# Altium schematic sheet Архитектура.SchDoc
size A4; SheetNumber: 1; SheetTotal: 3
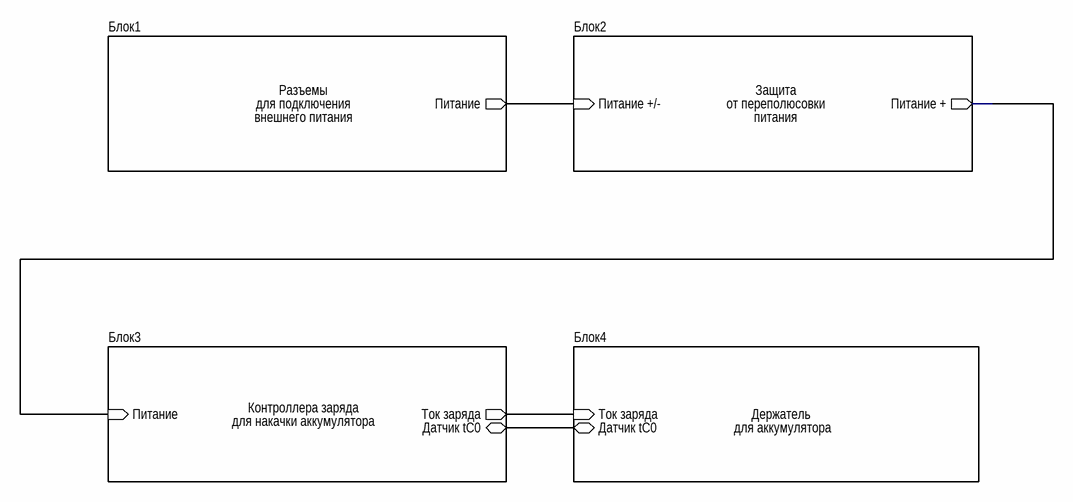
[diagram p0: Архитектура.SchDoc]

## Sub-sheets
Блок1 = Блок1.SchDoc: Питание (out)  | Parameter 1: Разъемы; Parameter 2: для подключения; Parameter 3: внешнего питания
Блок2 = Блок2.SchDoc: Питание +/- (in), Питание + (out)  | Parameter 1: Защита; Parameter 2: от переполюсовки; Parameter 3: питания
Блок3 = Блок3.SchDoc: Питание (in), Ток заряда (out), Датчик tC0 (bidir)  | Parameter 1: Контроллера заряда; Parameter 2: для накачки аккумулятора; Parameter 3: для накачки аккумулятора
Блок4 = Блок4.SchDoc: Ток заряда (in), Датчик tC0 (bidir)  | Parameter 1: Держатель; Parameter 2: для аккумулятора; Parameter 3: -

## Nets
(unnamed): sheet Блок1/Питание, sheet Блок2/Питание +/-
(unnamed): sheet Блок3/Питание, sheet Блок2/Питание +
(unnamed): sheet Блок3/Ток заряда, sheet Блок4/Ток заряда
(unnamed): sheet Блок3/Датчик tC0, sheet Блок4/Датчик tC0